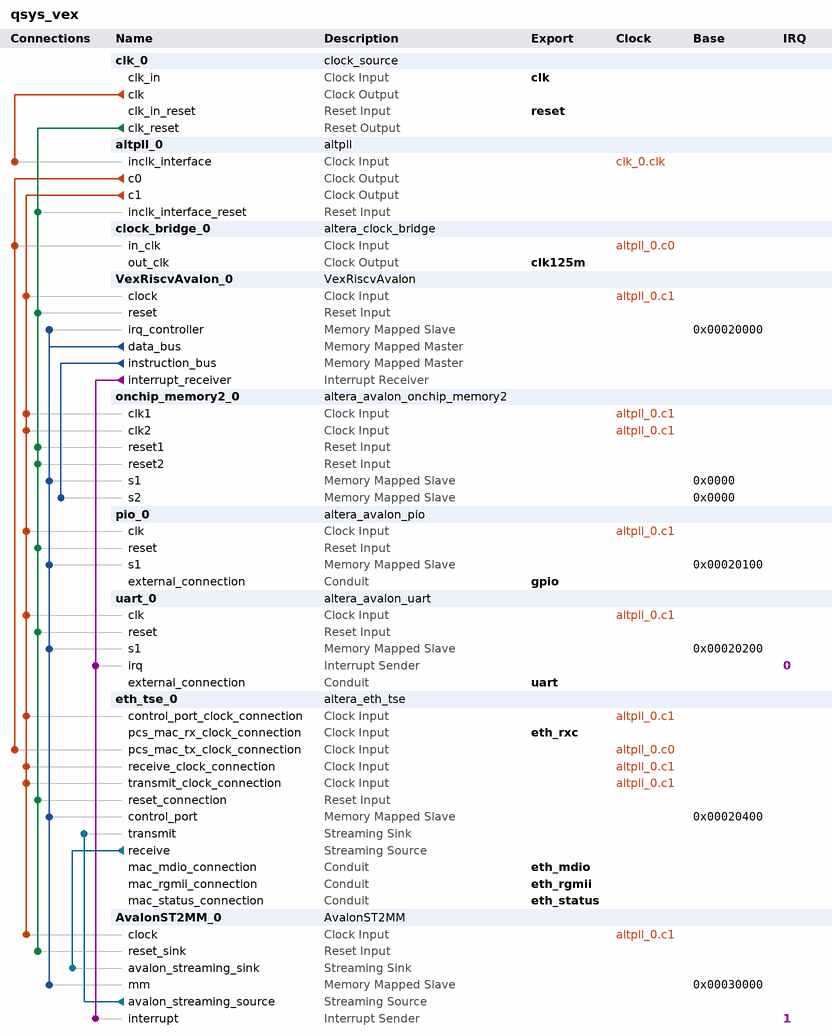
[diagram p0: system contents]
# Platform Designer (Qsys) system qsys_vex, Cyclone 10 LP 10CL055YU484I7G
# Parameters at their usual value, and those the tool derives, are not listed.
package require -exact qsys 20.1
create_system qsys_vex
set_project_property DEVICE_FAMILY {Cyclone 10 LP}
set_project_property DEVICE 10CL055YU484I7G

add_instance clk_0 clock_source 20.1
set_instance_parameter_value clk_0 clockFrequency 25000000

add_instance altpll_0 altpll 20.1
set_instance_parameter_value altpll_0 CLK0_DIVIDE_BY 1
set_instance_parameter_value altpll_0 CLK0_MULTIPLY_BY 5
set_instance_parameter_value altpll_0 CLK1_DIVIDE_BY 1
set_instance_parameter_value altpll_0 CLK1_DUTY_CYCLE 50
set_instance_parameter_value altpll_0 CLK1_MULTIPLY_BY 2
set_instance_parameter_value altpll_0 CLK1_PHASE_SHIFT 0
set_instance_parameter_value altpll_0 CLK2_DIVIDE_BY 1
set_instance_parameter_value altpll_0 CLK2_DUTY_CYCLE 50
set_instance_parameter_value altpll_0 CLK2_MULTIPLY_BY 2
set_instance_parameter_value altpll_0 CLK2_PHASE_SHIFT 0
set_instance_parameter_value altpll_0 CLK3_DIVIDE_BY 1
set_instance_parameter_value altpll_0 CLK3_DUTY_CYCLE 50
set_instance_parameter_value altpll_0 CLK3_MULTIPLY_BY 5
set_instance_parameter_value altpll_0 CLK3_PHASE_SHIFT 0
set_instance_parameter_value altpll_0 INCLK0_INPUT_FREQUENCY 40000
set_instance_parameter_value altpll_0 PORT_ARESET PORT_USED
set_instance_parameter_value altpll_0 PORT_LOCKED PORT_UNUSED
set_instance_parameter_value altpll_0 PORT_clk1 PORT_USED
set_instance_parameter_value altpll_0 PORT_clk2 PORT_UNUSED
set_instance_parameter_value altpll_0 PORT_clk3 PORT_UNUSED

add_instance clock_bridge_0 altera_clock_bridge 20.1
set_instance_parameter_value clock_bridge_0 DERIVED_CLOCK_RATE 125000000
set_instance_parameter_value clock_bridge_0 EXPLICIT_CLOCK_RATE 0

add_instance VexRiscvAvalon_0 VexRiscvAvalon 1.0
set_instance_parameter_value VexRiscvAvalon_0 CORE_CONFIG 1
set_instance_parameter_value VexRiscvAvalon_0 C_EXCEPTION_VECTOR 32
set_instance_parameter_value VexRiscvAvalon_0 C_IO_BEGIN 131072
set_instance_parameter_value VexRiscvAvalon_0 C_IO_END 4294967295
set_instance_parameter_value VexRiscvAvalon_0 C_RESET_VECTOR 16

add_instance onchip_memory2_0 altera_avalon_onchip_memory2 20.1
set_instance_parameter_value onchip_memory2_0 dataWidth 32
set_instance_parameter_value onchip_memory2_0 dualPort true
set_instance_parameter_value onchip_memory2_0 initMemContent true
set_instance_parameter_value onchip_memory2_0 initializationFileName ./bootrom_vex.mif
set_instance_parameter_value onchip_memory2_0 memorySize 131072
set_instance_parameter_value onchip_memory2_0 useNonDefaultInitFile true

add_instance pio_0 altera_avalon_pio 20.1
set_instance_parameter_value pio_0 bitModifyingOutReg true
set_instance_parameter_value pio_0 direction Bidir
set_instance_parameter_value pio_0 simDoTestBenchWiring true
set_instance_parameter_value pio_0 width 32

add_instance uart_0 altera_avalon_uart 20.1
set_instance_parameter_value uart_0 baud 115200
set_instance_parameter_value uart_0 dataBits 8
set_instance_parameter_value uart_0 fixedBaud true
set_instance_parameter_value uart_0 parity NONE
set_instance_parameter_value uart_0 stopBits 1

add_instance eth_tse_0 altera_eth_tse 20.1
set_instance_parameter_value eth_tse_0 XCVR_RCFG_JTAG_ENABLE 0
set_instance_parameter_value eth_tse_0 XCVR_SET_CAPABILITY_REG_ENABLE 0
set_instance_parameter_value eth_tse_0 XCVR_SET_CSR_SOFT_LOGIC_ENABLE 0
set_instance_parameter_value eth_tse_0 XCVR_SET_PRBS_SOFT_LOGIC_ENABLE 0
set_instance_parameter_value eth_tse_0 XCVR_SET_USER_IDENTIFIER 0
set_instance_parameter_value eth_tse_0 core_variation SMALL_MAC_GIGE
set_instance_parameter_value eth_tse_0 eg_addr 12
set_instance_parameter_value eth_tse_0 enable_hd_logic false
set_instance_parameter_value eth_tse_0 enable_mac_flow_ctrl false
set_instance_parameter_value eth_tse_0 enable_magic_detect false
set_instance_parameter_value eth_tse_0 enable_shift16 false
set_instance_parameter_value eth_tse_0 ifGMII RGMII
set_instance_parameter_value eth_tse_0 ing_addr 12
set_instance_parameter_value eth_tse_0 mdio_clk_div 40
set_instance_parameter_value eth_tse_0 stat_cnt_ena false
set_instance_parameter_value eth_tse_0 transceiver_type NONE

add_instance AvalonST2MM_0 AvalonST2MM 1.0

# connections
add_connection altpll_0.c0 clock_bridge_0.in_clk clock
add_connection altpll_0.c0 eth_tse_0.pcs_mac_tx_clock_connection clock
add_connection altpll_0.c1 AvalonST2MM_0.clock clock
add_connection altpll_0.c1 eth_tse_0.control_port_clock_connection clock
add_connection altpll_0.c1 eth_tse_0.receive_clock_connection clock
add_connection altpll_0.c1 eth_tse_0.transmit_clock_connection clock
add_connection altpll_0.c1 onchip_memory2_0.clk1 clock
add_connection altpll_0.c1 onchip_memory2_0.clk2 clock
add_connection altpll_0.c1 pio_0.clk clock
add_connection altpll_0.c1 uart_0.clk clock
add_connection altpll_0.c1 VexRiscvAvalon_0.clock clock
add_connection clk_0.clk altpll_0.inclk_interface clock
add_connection clk_0.clk_reset altpll_0.inclk_interface_reset reset
add_connection clk_0.clk_reset AvalonST2MM_0.reset_sink reset
add_connection clk_0.clk_reset eth_tse_0.reset_connection reset
add_connection clk_0.clk_reset onchip_memory2_0.reset1 reset
add_connection clk_0.clk_reset onchip_memory2_0.reset2 reset
add_connection clk_0.clk_reset pio_0.reset reset
add_connection clk_0.clk_reset uart_0.reset reset
add_connection clk_0.clk_reset VexRiscvAvalon_0.reset reset
add_connection VexRiscvAvalon_0.data_bus AvalonST2MM_0.mm avalon
set_connection_parameter_value VexRiscvAvalon_0.data_bus/AvalonST2MM_0.mm baseAddress 0x00030000
add_connection VexRiscvAvalon_0.data_bus eth_tse_0.control_port avalon
set_connection_parameter_value VexRiscvAvalon_0.data_bus/eth_tse_0.control_port baseAddress 0x00020400
add_connection VexRiscvAvalon_0.data_bus onchip_memory2_0.s1 avalon
set_connection_parameter_value VexRiscvAvalon_0.data_bus/onchip_memory2_0.s1 baseAddress 0x0000
add_connection VexRiscvAvalon_0.data_bus pio_0.s1 avalon
set_connection_parameter_value VexRiscvAvalon_0.data_bus/pio_0.s1 baseAddress 0x00020100
add_connection VexRiscvAvalon_0.data_bus uart_0.s1 avalon
set_connection_parameter_value VexRiscvAvalon_0.data_bus/uart_0.s1 baseAddress 0x00020200
add_connection VexRiscvAvalon_0.data_bus VexRiscvAvalon_0.irq_controller avalon
set_connection_parameter_value VexRiscvAvalon_0.data_bus/VexRiscvAvalon_0.irq_controller baseAddress 0x00020000
add_connection VexRiscvAvalon_0.instruction_bus onchip_memory2_0.s2 avalon
set_connection_parameter_value VexRiscvAvalon_0.instruction_bus/onchip_memory2_0.s2 baseAddress 0x0000
add_connection AvalonST2MM_0.avalon_streaming_source eth_tse_0.transmit avalon_streaming
add_connection eth_tse_0.receive AvalonST2MM_0.avalon_streaming_sink avalon_streaming
add_connection VexRiscvAvalon_0.interrupt_receiver AvalonST2MM_0.interrupt interrupt
set_connection_parameter_value VexRiscvAvalon_0.interrupt_receiver/AvalonST2MM_0.interrupt irqNumber 1
add_connection VexRiscvAvalon_0.interrupt_receiver uart_0.irq interrupt
set_connection_parameter_value VexRiscvAvalon_0.interrupt_receiver/uart_0.irq irqNumber 0

# exported interfaces
add_interface clk clock sink
set_interface_property clk EXPORT_OF clk_0.clk_in
add_interface clk125m clock source
set_interface_property clk125m EXPORT_OF clock_bridge_0.out_clk
add_interface eth_mdio conduit end
set_interface_property eth_mdio EXPORT_OF eth_tse_0.mac_mdio_connection
add_interface eth_rgmii conduit end
set_interface_property eth_rgmii EXPORT_OF eth_tse_0.mac_rgmii_connection
add_interface eth_rxc clock sink
set_interface_property eth_rxc EXPORT_OF eth_tse_0.pcs_mac_rx_clock_connection
add_interface eth_status conduit end
set_interface_property eth_status EXPORT_OF eth_tse_0.mac_status_connection
add_interface gpio conduit end
set_interface_property gpio EXPORT_OF pio_0.external_connection
add_interface reset reset sink
set_interface_property reset EXPORT_OF clk_0.clk_in_reset
add_interface uart conduit end
set_interface_property uart EXPORT_OF uart_0.external_connection

set_interconnect_requirement {$system} qsys_mm.clockCrossingAdapter HANDSHAKE
set_interconnect_requirement {$system} qsys_mm.enableEccProtection FALSE
set_interconnect_requirement {$system} qsys_mm.insertDefaultSlave FALSE
set_interconnect_requirement {$system} qsys_mm.maxAdditionalLatency 1

save_system qsys_vex.qsys
